# EAGLE design DesignVFD-Ring (EAGLE 9.4.2)
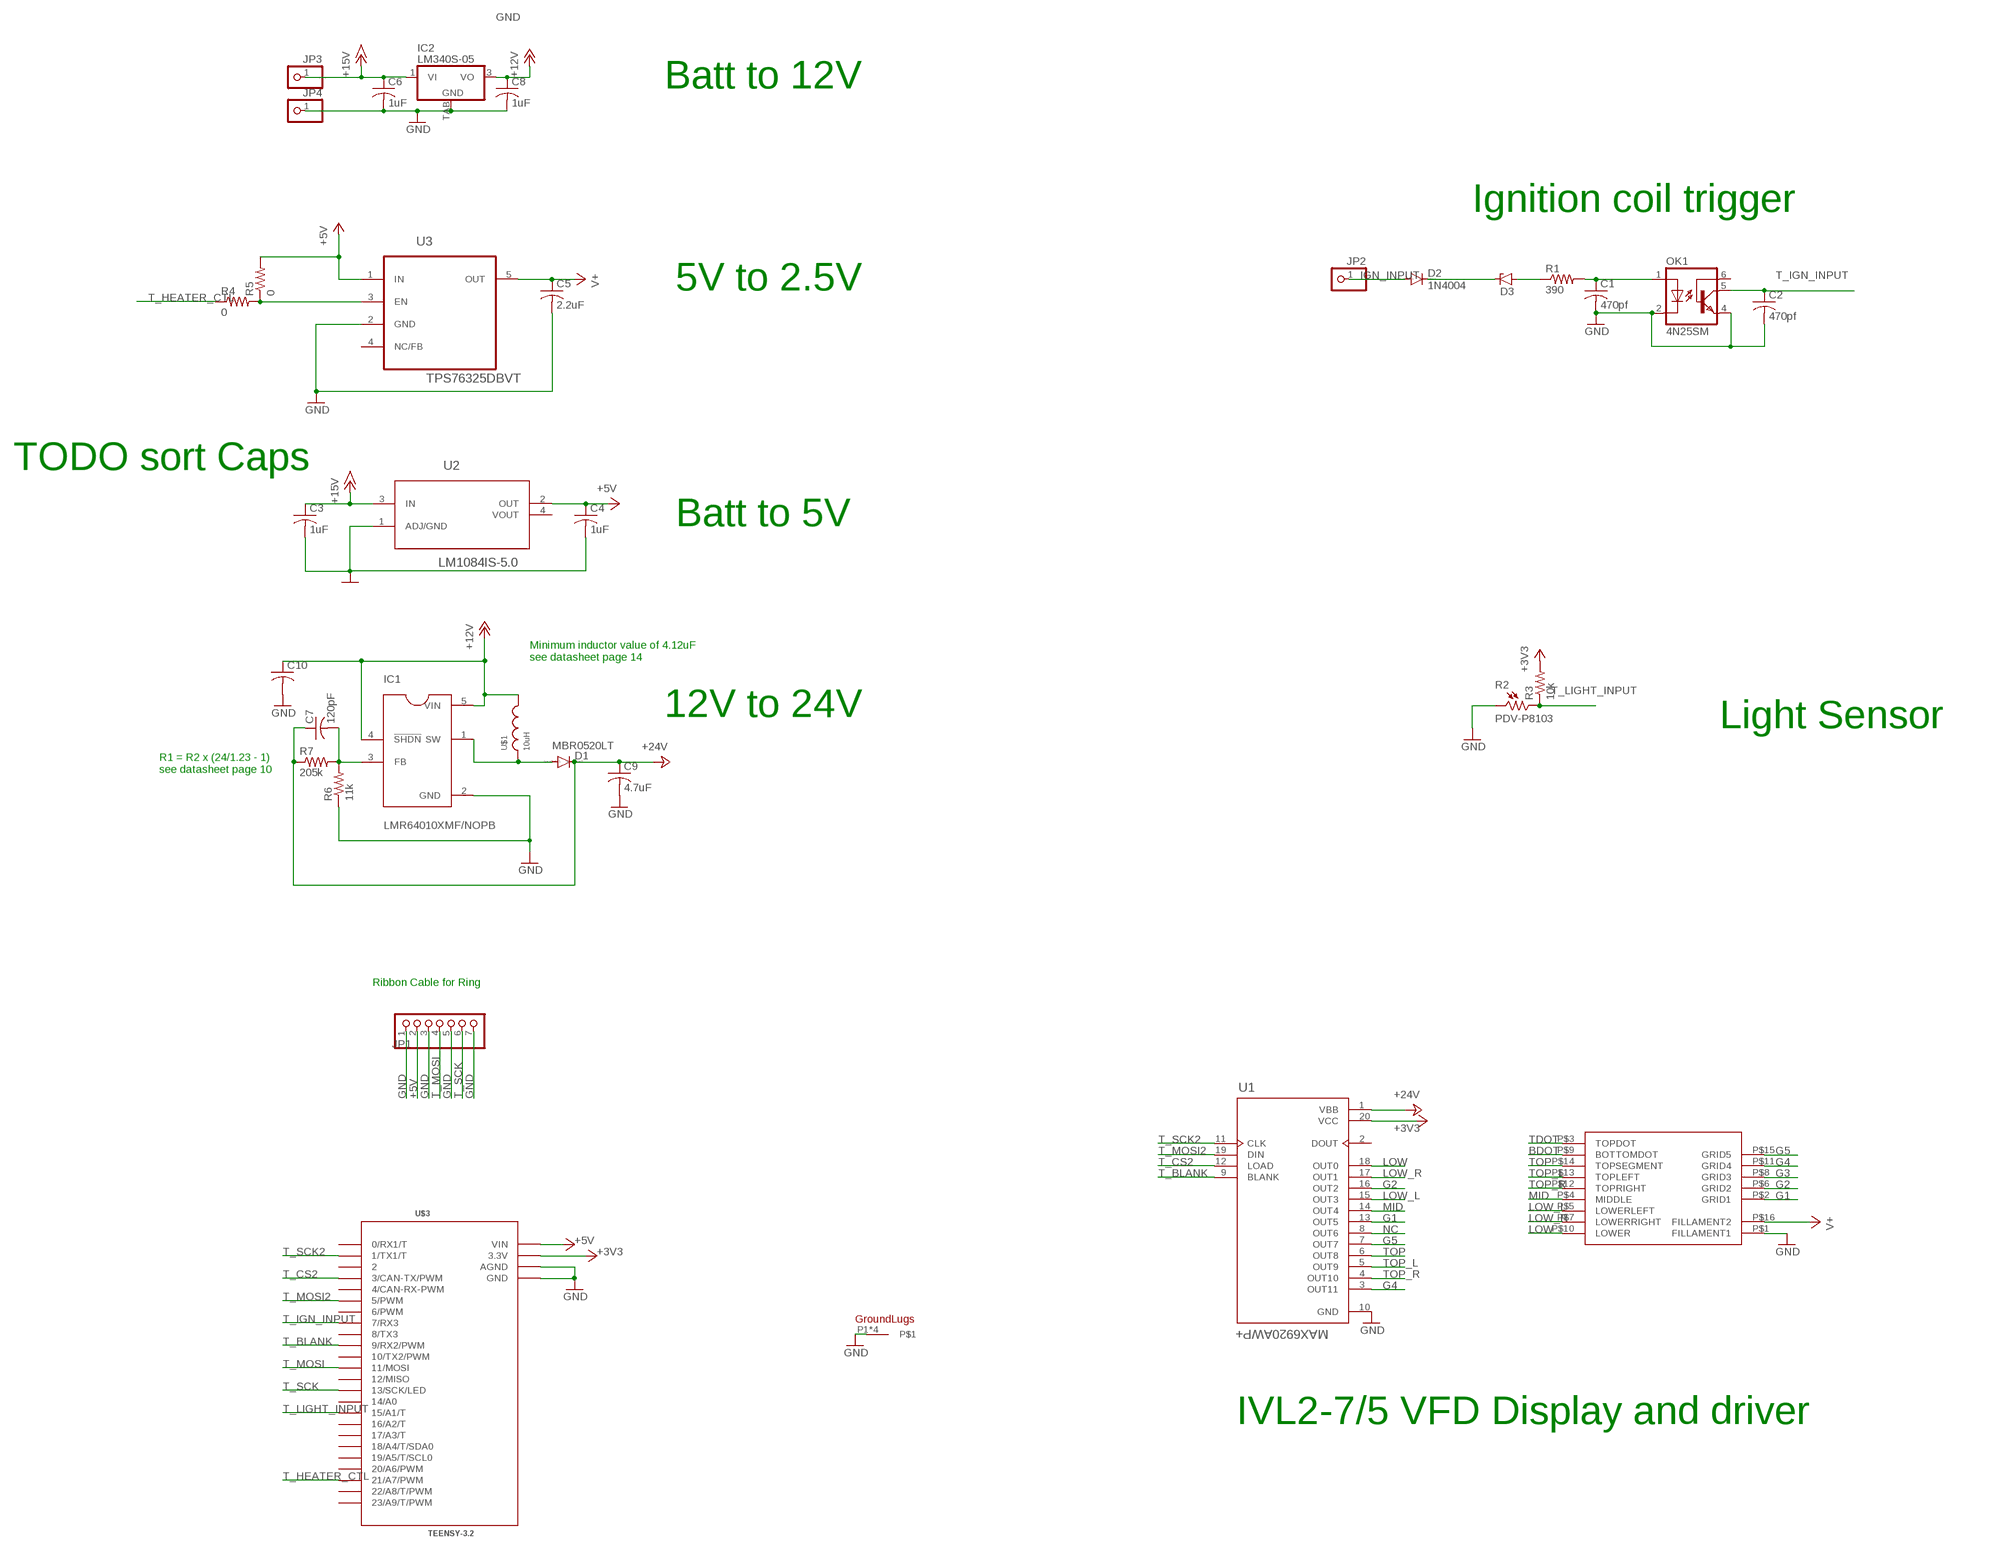
[diagram p0: schematic, sheet 1]

## Parts
C1  470pf  C-USC0805  [C0805]
C2  470pf  C-USC0805  [C0805]
C3  1uF  C-USC0805  [C0805]
C4  1uF  C-USC0805  [C0805]
C5  2.2uF  C-USC0805  [C0805]
C6  1uF  C-USC0805  [C0805]
C7  120pF  C-USC0805  [C0805]
C8  1uF  C-USC0805  [C0805]
C9  4.7uF  C-USC0805  [C0805]
C10  C-US025-050X050  [C025-050X050]
D1  MBR0520LT  [SOD123]
D2  1N4004  [DO41-10]
D3  ZENER-DIODEDO41Z10  [DO41Z10]
IC1  LMR64010XMF/NOPB  [SOT95P280X145-5N]
IC2  LM340S-05  [TO263-3]
JP1  PINHD-1X7  [1X07]
JP2  PINHD-1X1  [1X01]
JP3  PINHD-1X1  [1X01]
JP4  PINHD-1X1  [1X01]
OK1  4N25SM  [DIL6-SMD]
R1  390  R-US_R0805  [R0805]
R2  PDV-P8103  [PHODET_PDV-P8103]
R3  10k  R-US_R0805  [R0805]
R4  0  R-US_R0805  [R0805]
R5  0  R-US_R0805  [R0805]
R6  11k  R-US_R0805  [R0805]
R7  205k  R-US_R0805  [R0805]
U1  MAX6920AWP+  [SOIC127P1032X265-20N]
U2  LM1084IS-5.0  [TO254P1435X457-3N]
U3  TPS76325DBVT  [SOT95P280X145-5N]
U$1  10uH  732-1416-ND732-1416-ND  [732-1416-ND]
U$2  IVL2-7/5  [IVL2-7/5]
U$3  TEENSY-3.2  [TEENSY3.2]
U$4  LUMINI3  [STANDOFF-ELECTRICAL]

## Nets
+3V3: R3.2 U1.20(VCC) U$3.3V3+(3.3V)
+5V: C4.1 JP1.2 R5.2 U2.2(OUT) U3.1(IN) U$3.VIN
+12V: C8.1 C10.1 IC1.4(!SHDN) IC1.5(VIN) IC2.3(VO) U$1.P$2
+15V: C3.1 C6.1 IC2.1(VI) JP3.1 U2.3(IN)
+24V: C7.1 C9.1 D1.C R7.1 U1.1(VBB)
BDOT: U$2.P$9(BOTTOMDOT)
G1: U1.13(OUT5) U$2.P$2(GRID1)
G2: U1.16(OUT2) U$2.P$6(GRID2)
G3: U$2.P$8(GRID3)
G4: U1.3(OUT11) U$2.P$11(GRID4)
G5: U1.7(OUT7) U$2.P$15(GRID5)
GND: C1.2 C2.2 C3.2 C4.2 C5.2 C6.2 C8.2 C9.2 C10.2 IC1.2(GND) IC2.TAB(GND) JP1.1 JP1.3 JP1.5 JP1.7 JP4.1 OK1.2(C) OK1.4(EMI) R2.1 R6.1 U1.10(GND) U2.1(ADJ/GND) U3.2(GND) U$2.P$1(FILLAMENT1) U$3.AGND U$3.GND U$4.P1 U$4.P2 U$4.P3 U$4.P4
IGN_INPUT: D2.A JP2.1
LOW: U1.18(OUT0) U$2.P$10(LOWER)
LOW_L: U1.15(OUT3) U$2.P$5(LOWERLEFT)
LOW_R: U1.17(OUT1) U$2.P$7(LOWERRIGHT)
MID: U1.14(OUT4) U$2.P$4(MIDDLE)
N$1: R4.2 R5.1 U3.3(EN)
N$2: D2.C D3.C
N$3: D3.A R1.1
N$4: C1.1 OK1.1(A) R1.2
N$6: D1.A IC1.1(SW) U$1.P$1
N$7: C7.2 IC1.3(FB) R6.2 R7.2
NC: U1.8(OUT6)
T_BLANK: U1.9(BLANK) U$3.9(9/RX2/PWM)
T_CS2: U1.12(LOAD) U$3.3(3/CAN-TX/PWM)
T_HEATER_CTL: R4.1 U$3.21(21/A7/PWM)
T_IGN_INPUT: C2.1 OK1.5(COL) U$3.7(7/RX3)
T_LIGHT_INPUT: R2.2 R3.1 U$3.15(15/A1/T)
T_MOSI: JP1.4 U$3.11(11/MOSI)
T_MOSI2: U1.19(DIN) U$3.5(5/PWM)
T_SCK: JP1.6 U$3.13(13/SCK/LED)
T_SCK2: U1.11(CLK) U$3.1(1/TX1/T)
TDOT: U$2.P$3(TOPDOT)
TOP: U1.6(OUT8) U$2.P$14(TOPSEGMENT)
TOP_L: U1.5(OUT9) U$2.P$13(TOPLEFT)
TOP_R: U1.4(OUT10) U$2.P$12(TOPRIGHT)
V+: C5.1 U3.5(OUT) U$2.P$16(FILLAMENT2)
Unconnected: OK1.6(BAS) U1.2(DOUT) U2.4(VOUT) U3.4(NC/FB) U$3.0(0/RX1/T) U$3.2 U$3.4(4/CAN-RX-PWM) U$3.6(6/PWM) U$3.8(8/TX3) U$3.10(10/TX2/PWM) U$3.12(12/MISO) U$3.14(14/A0) U$3.16(16/A2/T) U$3.17(17/A3/T) U$3.18(18/A4/T/SDA0) U$3.19(19/A5/T/SCL0) U$3.20(20/A6/PWM) U$3.22(22/A8/T/PWM) U$3.23(23/A9/T/PWM)

## Notes on the sheet
- Batt to 12V
- Ignition coil trigger
- 5V to 2.5V
- TODO sort Caps
- Batt to 5V
- Minimum inductor value of 4.12uF
  see datasheet page 14
- 12V to 24V | Light Sensor
- R1 = R2 x (24/1.23 - 1)
  see datasheet page 10
- Ribbon Cable for Ring
- IVL2-7/5 VFD Display and driver

## Library data of the parts
C1-C10 = rcl:C-US: CAPACITOR, American symbol; SPICEPREFIX: C
D1 = diode:MBR0520LT: SCHOTTKY BARRIER RECTIFIER Source: http://onsemi.com .. MBR0520LT1-D.pdf
D2 = diode:1N4004: DIODE general purpose rectifier, 1 A
D3 = diode:ZENER-DIODE: Z-Diode
IC1 = LMR64010XMF_NOPB:LMR64010XMF/NOPB: SIMPLE SWITCHER? 2.7V to 14V, 1A Step-Up Regulator in SOT-23 Package 5-SOT-23 -40 to 125; DESCRIPTION: SIMPLE SWITCHER? 2.7V to 14V, 1A Step-Up Regulator in SOT-23 Package 5-SOT-23 -40 to 125; DIGI-KEY_PART_NUMBER: 296-38770-1-ND; DIGI-KEY_PURCHASE_URL: https://www.digikey.com/product-detail/en/texas-instruments/LMR64010XMF-NOPB/296-38770-1-ND/5125872?utm_source=snapeda&utm_medium=aggregator&utm_campaign=symbol; MF: Texas Instruments; MP: LMR64010XMF/NOPB; PACKAGE: SOT-23-5 Texas Instruments
IC2 = linear:LM340?-*: Positive VOLTAGE REGULATOR Source: http://cache.national.com/ds/LM/LM340.pdf
JP1 = pinhead:PINHD-1X7: PIN HEADER
JP2-JP4 = pinhead:PINHD-1X1: PIN HEADER
OK1 = 4N25SM:4N25SM: General Purpose 6-Pin Phototransistor Optocouplers Source: http://www.fairchildsemi.com/ds/4N/4N35-M.pdf; AVAILABILITY: Unavailable; DESCRIPTION: 4N25SM; MF: ON Semiconductor; MP: 4N25SM; PACKAGE: SMD-6 ON Semiconductor; PRICE: None
R1 R3-R7 = rcl:R-US_: RESISTOR, American symbol; SPICEPREFIX: R
R2 = PDV-P8103:PDV-P8103: THT Photocell 16-33 Kohm; AVAILABILITY: Unavailable; DESCRIPTION: Photocell 16-33kohm; MF: Advanced Photonix; MP: PDV-P8103; PACKAGE: Radial Advanced Photonix; PRICE: None
U1 = MAX6920AWP_:MAX6920AWP+: None; DESCRIPTION: 12-Output, 76V, Serial-Interfaced VFD Tube Driver; DIGI-KEY_PART_NUMBER: MAX6920AWP+-ND; DIGI-KEY_PURCHASE_URL: https://www.digikey.com/product-detail/en/maxim-integrated/MAX6920AWP-/MAX6920AWP--ND/1512955?utm_source=snapeda&utm_medium=aggregator&utm_campaign=symbol; MF: Maxim Integrated; MP: MAX6920AWP+; PACKAGE: SOIC-20 Maxim
U2 = LM1084IS-5.0:LM1084IS-5.0: Low Dropout Positive Regulators; AVAILABILITY: Unavailable; MF: Texas Instruments; MP: LM1084IS50; PACKAGE: None; PRICE: None
U3 = TPS76325DBVT:TPS76325DBVT: Low Power 150mA Low Dropout Linear Regulators; DESCRIPTION: LDO Regulator Pos 2.5V 0.15A 5-Pin SOT-23 T/R; DIGI-KEY_PART_NUMBER: 296-2701-1-ND; DIGI-KEY_PURCHASE_URL: https://www.digikey.com/product-detail/en/texas-instruments/TPS76325DBVT/296-2701-1-ND/381513?utm_source=snapeda&utm_medium=aggregator&utm_campaign=symbol; MF: Texas Instruments; MP: TPS76325DBVT; PACKAGE: SOT-23-5 Texas Instruments
U$1 = FormE:732-1416-ND
U$2 = FormE:IVL2-7/5
U$3 = FormE:TEENSY-3.2
U$4 = FormE:LUMINI3

## Board
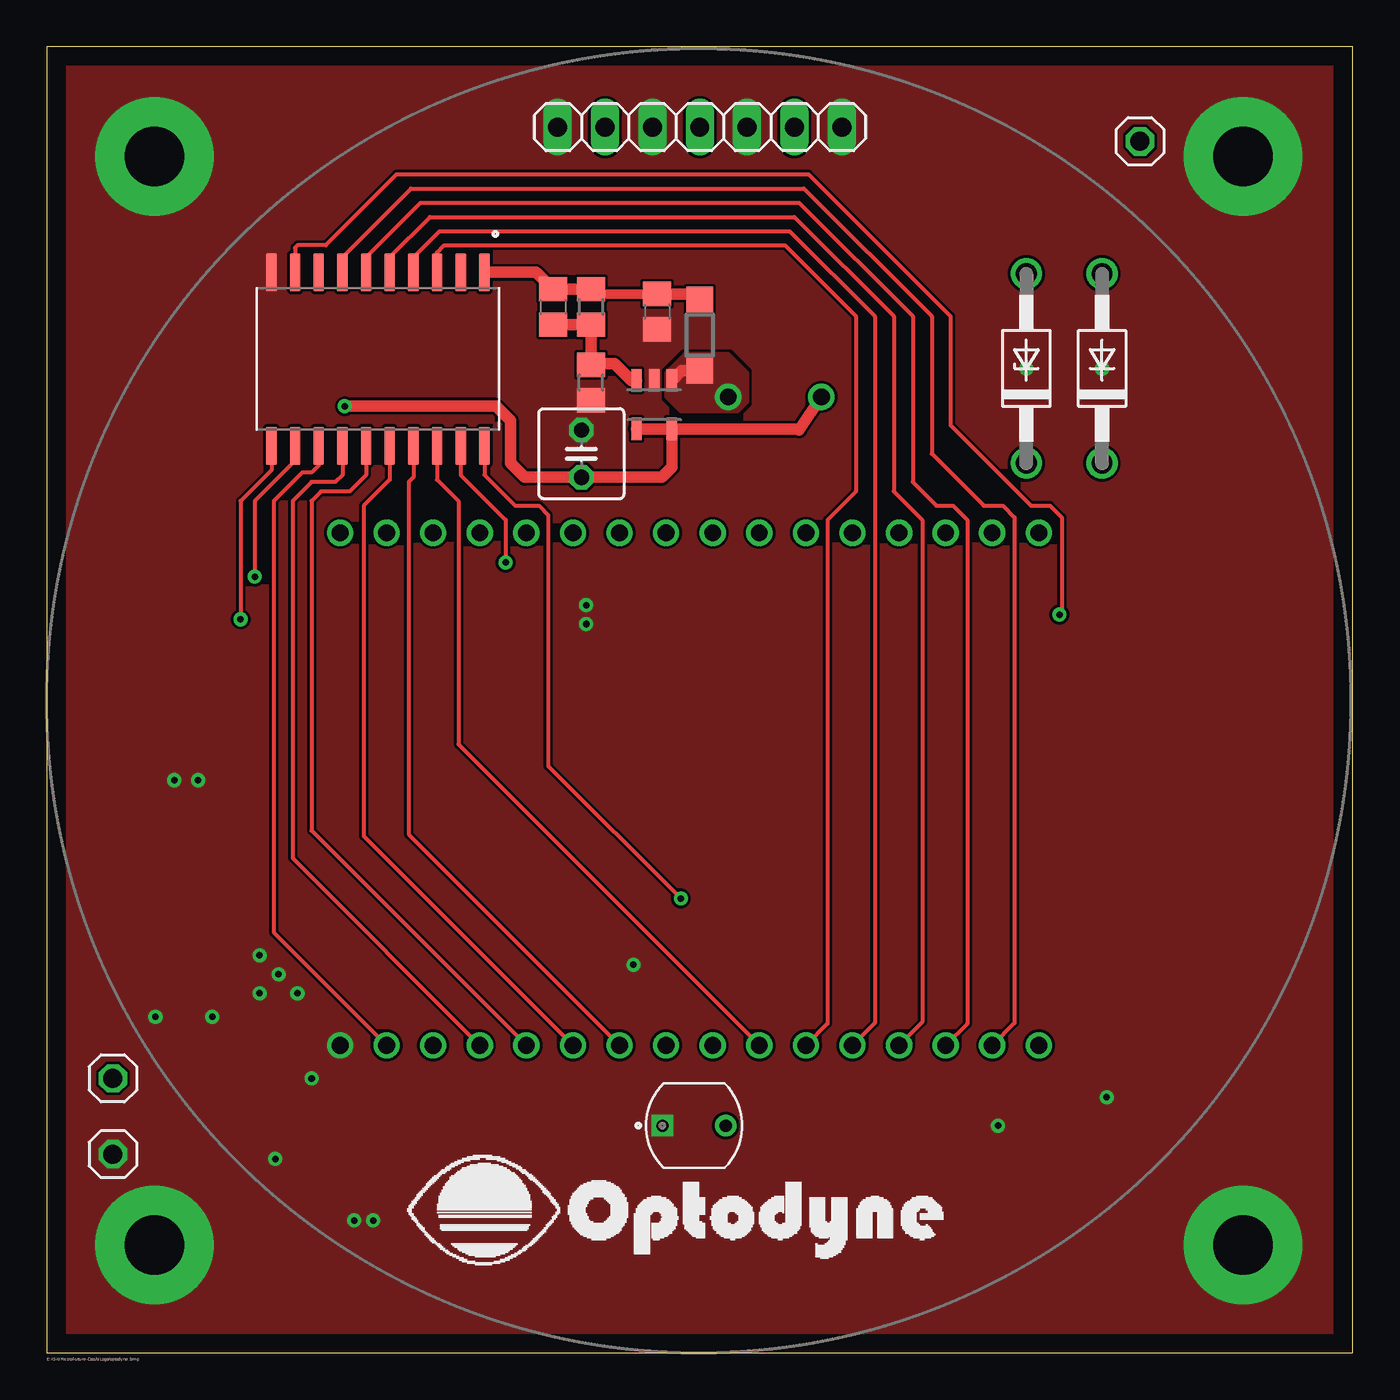
[diagram p1: board, top side]
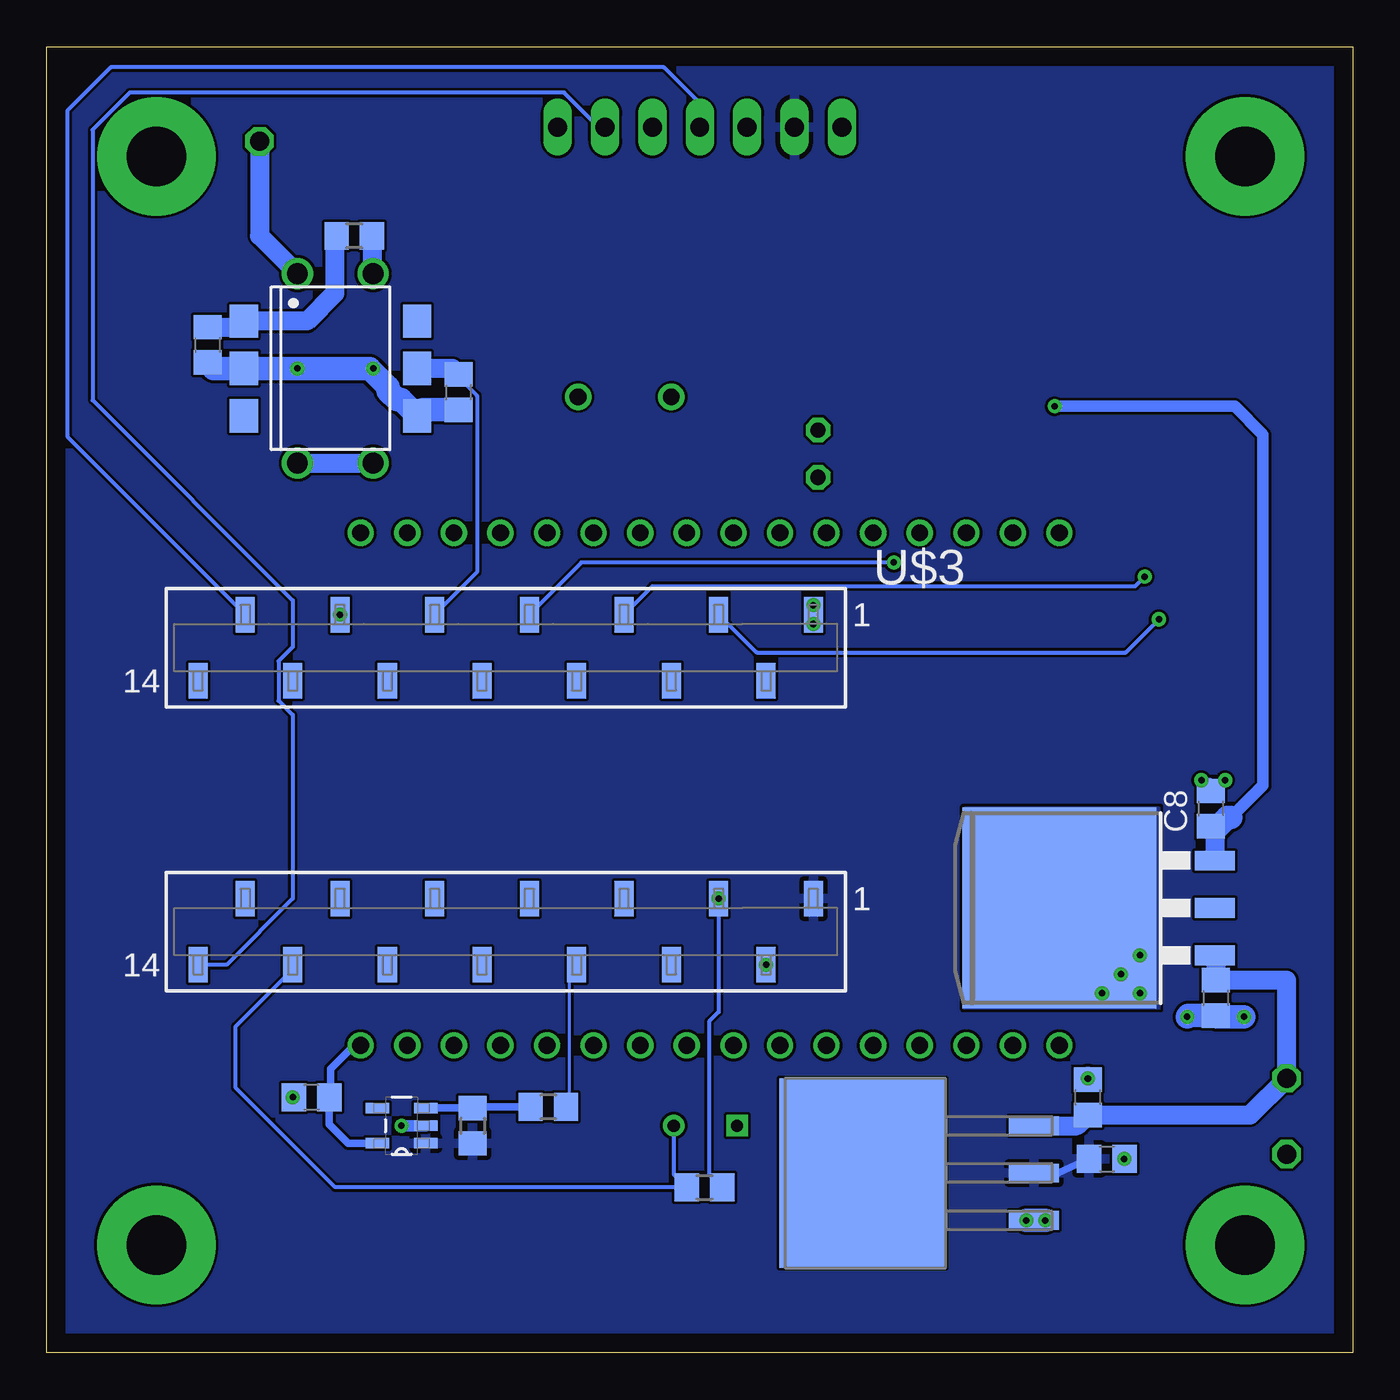
[diagram p2: board, bottom side, seen from below]

Size 70.1 x 70.1 mm. Coordinates in mm from the lower left corner, seen from the top.
Outline: 0,0 70.1,0 70.1,70.1 0,70.1 0,0
Copper layers (1*16): Top 0.035mm / dielectric 1.5mm / Bottom 0.035mm
Design rules "default": minimum track width 6mil, minimum drill 0.35mm, track to track 6mil, track to pad 6mil, pad to pad 6mil, via to via 6mil, smd to smd 6mil, copper to edge 40mil, drill to drill 6mil, minimum pad ring 10mil, minimum via ring 8mil, stop-mask expansion 4mil, vias tented up to drill 0mil, thermal gap 10mil

### Footprints (pad centres in the part's own frame; a part is rotated, then mirrored left to right if it is on the bottom)
C0805 = smd 1.3 x 1.5: 1 -0.95,0; 2 0.95,0
C025-050X050 = drill 0.813 octagon: 1 -1.27,0; 2 1.27,0
SOD123 = smd 1.4 x 1.4: A 1.9,0; C -1.9,0
DO41-10 = drill 1.118: A 5.08,0; C -5.08,0
DO41Z10 = drill 1.118: A 5.08,0; C -5.08,0
SOT95P280X145-5N = smd 0.55 x 1.2: 1 -1.044,-1.131; 2 -0.094,-1.131; 3 0.856,-1.131; 4 0.856,1.469; 5 -1.044,1.469
TO263-3 = smd 1.067 x 2.159: 1 -2.54,-5.791; 2 0,-5.791; 3 2.54,-5.791 | smd 10.8 x 10.41: TAB 0,2.54
1X07 = drill 1.016 long: 1 -7.62,0; 2 -5.08,0; 3 -2.54,0; 4 0,0; 5 2.54,0; 6 5.08,0; 7 7.62,0
1X01 = drill 1.016 octagon: 1 0,0
DIL6-SMD = smd 1.78 x 1.52: 1 -2.54,-4.645; 2 0,-4.645; 3 2.54,-4.645; 4 2.54,4.645; 5 0,4.645; 6 -2.54,4.645
R0805 = smd 1.3 x 1.5: 1 -0.95,0; 2 0.95,0
PHODET_PDV-P8103 = drill 0.65 square: 1 -1.7,0 | drill 0.65: 2 1.7,0
SOIC127P1032X265-20N = smd 2.05 x 0.59: 1 -4.655,5.715; 2 -4.655,4.445; 3 -4.655,3.175; 4 -4.655,1.905; 5 -4.655,0.635; 6 -4.655,-0.635; 7 -4.655,-1.905; 8 -4.655,-3.175; 9 -4.655,-4.445; 10 -4.655,-5.715; 11 4.655,-5.715; 12 4.655,-4.445; 13 4.655,-3.175; 14 4.655,-1.905; 15 4.655,-0.635; 16 4.655,0.635; 17 4.655,1.905; 18 4.655,3.175; 19 4.655,4.445; 20 4.655,5.715
TO254P1435X457-3N = smd 1.016 x 2.692: 1 -2.54,-9.042; 2 0,-9.042; 3 2.54,-9.042 | smd 10.16 x 8.941: 4 0,0.152
SOT95P280X145-5N' = smd 1.27 x 0.559: 1 -1.295,0.94; 2 -1.295,0; 3 -1.295,-0.94; 4 1.295,-0.94; 5 1.295,0.94
732-1416-ND = drill 0.9: P$1 0,0; P$2 5,0
IVL2-7/5 = drill 0.9: P$1 0,0; P$2 2.5,0; P$3 5,0; P$4 7.5,0; P$5 10,0; P$6 12.5,0; P$7 15,0; P$8 17.5,0; P$9 20,0; P$10 22.5,0; P$11 25,0; P$12 27.5,0; P$13 30,0; P$14 32.5,0; P$15 35,0; P$16 37.5,0; P$17 0,27.5; P$18 2.5,27.5; P$19 5,27.5; P$20 7.5,27.5; P$21 10,27.5; P$22 12.5,27.5; P$23 15,27.5; P$24 17.5,27.5; P$25 20,27.5; P$26 22.5,27.5; P$27 25,27.5; P$28 27.5,27.5; P$29 30,27.5; P$30 32.5,27.5; P$31 35,27.5; P$32 37.5,27.5
TEENSY3.2 = smd 1.02 x 1.905: 0 2.54,4.318; 1 5.08,0.762; 2 7.62,4.318; 3 10.16,0.762; 3V3+ 5.08,16.002; 4 12.7,4.318; 5 15.24,0.762; 6 17.78,4.318; 7 20.32,0.762; 8 22.86,4.318; 9 25.4,0.762; 10 27.94,4.318; 11 30.48,0.762; 12 33.02,4.318; 13 33.02,19.558; 14 30.48,16.002; 15 27.94,19.558; 16 25.4,16.002; 17 22.86,19.558; 18 20.32,16.002; 19 17.78,19.558; 20 15.24,16.002; 21 12.7,19.558; 22 10.16,16.002; 23 7.62,19.558; AGND 2.54,19.558; GND 0,0.762; VIN 0,16.002
STANDOFF-ELECTRICAL = drill 3.2 pad 6.35: P1 -29.21,29.21; P2 -29.21,-29.21; P3 29.21,29.21; P4 29.21,-29.21

### Placement (x,y rotation side)
C1  61.47,54.1 270 bottom
C2  48.01,51.56 270 bottom
C3  14.22,13.72 90 bottom
C4  13.21,10.41 0 bottom
C5  55.88,13.72 180 bottom
C6  7.37,19.05 270 bottom
C7  27.18,56.13 270 top
C8  7.62,29.21 90 bottom
C9  32.77,55.88 270 top
C10  28.7,48.26 90 top
D1  35.05,54.61 270 top
D2  56.64,52.83 90 top
D3  52.58,52.83 90 top
IC1  32.51,51.05 180 top
IC2  13.21,23.88 90 bottom
JP1  35.05,65.79 0 top
JP2  58.67,65.02 90 top
JP3  3.56,14.73 0 top
JP4  3.56,10.67 0 top
OK1  54.86,52.83 270 bottom
R1  53.59,59.94 180 bottom
R2  34.75,12.19 0 top
R3  34.8,8.89 0 bottom
R4  43.18,13.21 180 bottom
R5  47.24,12.19 270 bottom
R6  29.21,52.07 90 top
R7  29.21,56.13 270 top
U1  17.78,53.34 270 top
U2  26.16,9.65 90 bottom
U3  TPS76325DBVT  [SOT95P280X145-5N']  51.05,12.19 180 bottom
U$1  36.58,51.31 0 top
U$2  15.75,16.51 0 top
U$3  28.96,40.39 180 bottom
U$4  35,35 0 top

### Tracks (layer width: path | path; a pad name or v marks a point on that pad's centre or on a via)
+3V3  (via drill 0.35)
  Top 0.203: U1.20 23.5,47.12 25.15,45.47 26.42,45.47 26.92,44.96 26.92,31.5 U$3.3V3+
  Bottom 0.203: U$3.3V3+ 34.04,18.29 34.54,17.78 34.54,9.59 R3.2
  other vias: 34.04,24.38
+5V
  Bottom 0.406: U2.2 15.81,9.65 C4.1
  pour Bottom (rank 4): 0,0 0,70.1 69.85,70.1 69.85,0
+12V  (via drill 0.35)
  Top 0.61: v16,50.8 24.13,50.8 24.89,50.04 24.89,47.75 25.65,46.99 C10.1 33.02,46.99 33.56,47.53 IC1.5 | IC1.5 40.33,49.59 40.39,49.53 U$1.P$2 | IC1.4 IC1.5
  Bottom 0.61: v16,50.8 6.35,50.8 4.83,49.28 4.83,30.44 6.54,28.72
  Bottom 1.016: C8.1 7.42,28.06 IC2.3
  Bottom 1.27: 6.54,28.72 6.75,28.72 7.42,28.06
+15V
  Bottom 1.016: IC2.1 7.37,21.29 C6.1 3.56,20 JP3.1 5.52,12.77 C3.1 14.8,12.19 U2.3
+24V
  Top 0.203: 30.08,56.83 29.46,56.83 R7.1
  Top 0.508: C9.1 30.08,56.83
  Top 0.61: D1.C 34.74,56.83 C9.1 | U1.1 26.27,57.99 C7.1 R7.1
G1
  Top 0.203: U$2.P$2 12.19,22.57 12.19,45.72 13.72,47.24 14.22,47.24 14.61,47.62 U1.13
G2
  Top 0.203: U1.16 18.41,46.86 17.02,45.47 17.02,27.74 U$2.P$6
G4
  Top 0.203: U1.3 20.95,59.05 21.34,59.44 39.62,59.44 43.43,55.63 43.43,46.23 41.91,44.7 41.91,17.67 U$2.P$11
G5
  Top 0.203: U1.7 15.88,58.8 19.56,62.48 40.64,62.48 47.5,55.63 47.5,48.26 50.29,45.47 51.31,45.47 51.94,44.83 51.94,17.7 U$2.P$15
GND  (via drill 0.35)
  Bottom 0.152: C4.2 12.61,10.06 12.61,9.82 12.19,9.82 12.19,10.33 v12.28,10.41
  Bottom 0.203: U$3.GND v28.96,39.12 | C5.2 v56.9,13.72 | C8.2 7.62,30.73 v8.13,30.73
  Bottom 0.61: U3.2 v51.05,12.19
  Bottom 1.27: v5.84,18.03 7.3,18.03 C6.2 8.82,18.1 v8.89,18.03 | C3.2 v14.22,14.73 | v17.53,7.11 U2.1 v16.51,7.11 | C2.2 49.9,50.61 OK1.4 51.08,51.16 51.3,51.16 51.77,51.62 51.77,51.84 52.76,52.83 v56.64,52.83 OK1.2 61.15,52.83 C1.2
  other vias: 52.58,52.83 31.5,20.83 28.96,40.13 6.86,30.73 11.43,19.3 12.45,20.32 13.46,19.3 11.43,21.34
  pour Top (rank 4, no thermals): 0,0 0,70.1 70.1,70.1 70.1,0
  pour Bottom (no thermals): 10.41,18.54 10.41,29.21 20.83,29.21 20.83,18.54
IGN_INPUT
  Bottom 1.016: JP2.1 58.67,59.94 D2.A
LOW
  Top 0.203: U1.18 20.95,46.86 22.1,45.72 22.1,32.66 U$2.P$10
LOW_L
  Top 0.203: U1.15 17.14,47.12 16.26,46.23 14.73,46.23 14.22,45.72 14.22,28.03 U$2.P$5
LOW_R
  Top 0.203: U1.17 19.68,46.99 19.43,46.74 19.43,27.83 U$2.P$7
MID
  Top 0.203: U1.14 15.88,47.12 15.49,46.74 14.22,46.74 13.21,45.72 13.21,26.55 U$2.P$4
N$1
  Bottom 0.406: R4.2 47.18,13.21 R5.1 49.75,13.14 U3.3
N$2
  Bottom 1.016: D2.C D3.C
N$3
  Bottom 1.016: R1.1 52.64,57.98 D3.A
N$4
  Bottom 1.016: C1.1 59.83,55.05 OK1.1 56.13,55.37 54.63,56.87 54.63,59.85 R1.2
N$6
  Top 0.61: IC1.1 34.08,52.71 D1.A
  pour Top (no thermals): 33.27,51.31 33.27,52.58 34.29,53.59 36.58,53.59 37.59,52.58 37.59,51.05 37.08,50.55 34.04,50.55
N$7
  Top 0.61: C7.2 R7.2 R6.2 29.28,53.09 30.48,53.09 31.38,52.19 IC1.3
T_BLANK  (via drill 0.35)
  Top 0.203: U$3.9 54.48,39.75 54.48,44.83 53.85,45.47 52.83,45.47 48.51,49.78 48.51,55.63 40.89,63.25 18.8,63.25 14.99,59.44 13.46,59.44 13.34,59.31 U1.9
  other vias: 54.36,39.62
T_CS2  (via drill 0.35)
  Top 0.203: U1.12 13.34,47.88 11.18,45.72 v11.18,41.66
  Bottom 0.203: v11.18,41.66 11.68,41.15 37.59,41.15 U$3.3
T_HEATER_CTL
  Bottom 0.152: R4.1 42.23,13.65 42.04,13.84 42.04,20.45 U$3.21
T_IGN_INPUT
  Bottom 0.203: C2.1 48.01,52.37 47,51.37 47,41.9 U$3.7
  Bottom 1.016: C2.1 48.33,52.83 OK1.5
T_LIGHT_INPUT
  Bottom 0.203: R2.2 36.45,9.59 R3.1 54.61,8.89 59.94,14.22 59.94,17.53 56.9,20.57 U$3.15
T_MOSI
  Bottom 0.203: JP1.4 35.05,67.06 36.98,68.99 66.65,68.99 68.99,66.65 68.99,49.17 U$3.11
T_MOSI2  (via drill 0.35)
  Top 0.203: U1.19 22.23,47.12 24.64,44.7 v24.64,42.42
  Bottom 0.203: U$3.5 41.4,42.42 v24.64,42.42
T_SCK
  Bottom 0.203: U$3.13 60.45,20.83 56.9,24.38 56.9,34.25 57.66,35.01 57.66,37.13 56.9,37.89 56.9,40.39 67.64,51.13 67.64,65.63 65.63,67.64 42.33,67.64 40.47,65.79 JP1.6
T_SCK2  (via drill 0.35)
  Top 0.203: U1.11 12.06,47.37 10.41,45.72 v10.41,39.37
  Bottom 0.203: v10.41,39.37 12.19,37.59 32,37.59 U$3.1
TOP
  Top 0.203: U1.6 17.14,58.8 20.07,61.72 40.39,61.72 46.48,55.63 46.48,46.74 47.75,45.47 48.64,45.47 49.4,44.7 49.4,17.66 U$2.P$14
TOP_L
  Top 0.203: U1.5 18.41,58.8 20.57,60.96 40.13,60.96 45.47,55.63 45.47,46.23 46.99,44.7 46.99,17.75 U$2.P$13
TOP_R
  Top 0.203: U1.4 19.68,58.8 21.08,60.2 39.88,60.2 44.45,55.63 44.45,17.71 U$2.P$12
V+
  Bottom 0.406: U3.5 53.92,11.25 54.93,12.26 C5.1 54.86,13.78 54.86,15.24 53.59,16.51 U$2.P$16

### Text on the board
tPlace: E:/Git/RetroFuture-Dash/Logo/optodyne.bmp
200bmp: E:/Git/RetroFuture-Dash/logo.bmp